# Altium project Projet_travelling_detecteur_V3.PrjPCB
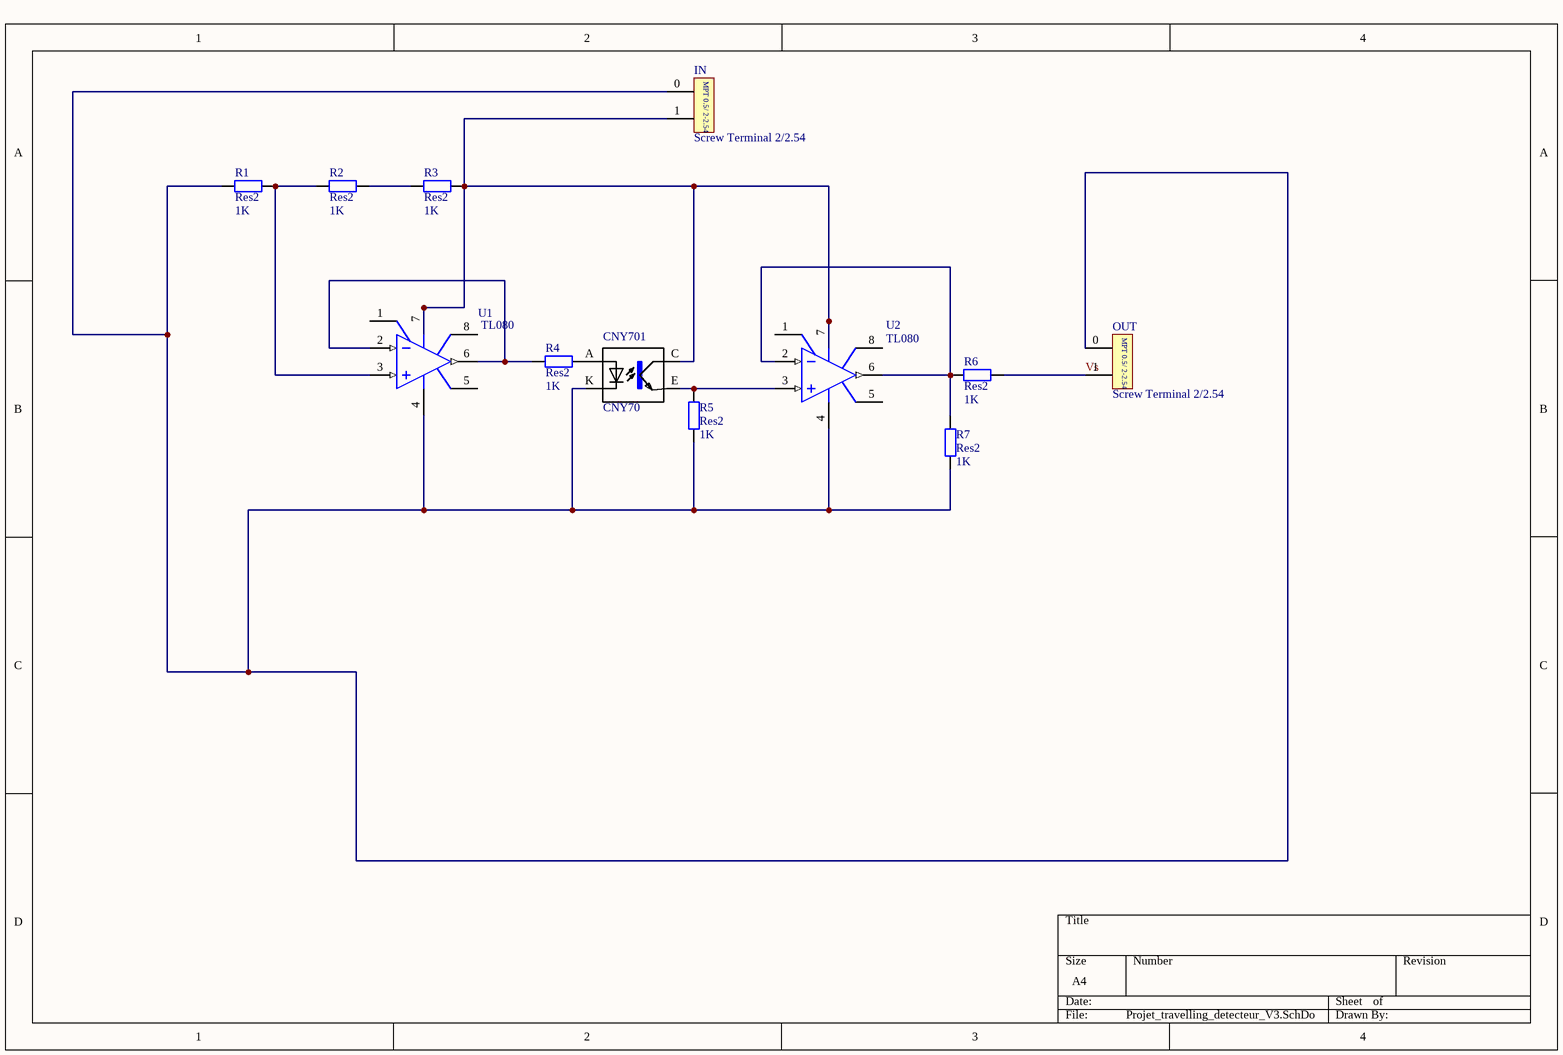
[diagram p0: Projet_travelling_detecteur_V3.SchDoc]
1 sheet, 12 parts. Net scope: global (net labels, ports and power ports of the same name join across sheets).
Board file: Projet_travelling_detecteur_V3.PcbDoc

## Sheet Projet_travelling_detecteur_V3.SchDoc
size A4

### Parts
CNY701  CNY70  [*4_CNY70(Primary)]
IN  Screw Terminal 2/2.54  [MPT_0.5-2-2.54]
OUT  Screw Terminal 2/2.54  [MPT_0.5-2-2.54]
R1  Res2  value 1K  [AXIAL-0.4]
R2  Res2  value 1K  [AXIAL-0.4]
R3  Res2  value 1K  [AXIAL-0.4]
R4  Res2  value 1K  [AXIAL-0.4]
R5  Res2  value 1K  [AXIAL-0.4]
R6  Res2  value 1K  [AXIAL-0.4]
R7  Res2  value 1K  [AXIAL-0.4]
U1  TL080  [DIL 8]
U2  TL080  [DIL 8]

### Nets
Vs: OUT.1 R6.2
NetCNY701_A: CNY701.A R4.2
NetCNY701_C: CNY701.C(COL) IN.1 R3.2 U1.7(V+) U2.7(V+)
NetCNY701_E: CNY701.E(EMI) R5.1 U2.3(IN+)
NetCNY701_K: CNY701.K(C) IN.0 OUT.0 R1.1 R5.2 R7.1 U1.4(V-) U2.4(V-)
NetR1_2: R1.2 R2.1 U1.3(IN+)
NetR2_2: R2.2 R3.1
NetR4_1: R4.1 U1.2(IN-) U1.6(OUT)
NetR6_1: R6.1 R7.2 U2.2(IN-) U2.6(OUT)

Not connected (* = marked no-connect by the designer): U1 1(BAL1/CMPEN) 5(BAL2) 8(CMPEN); U2 1(BAL1/CMPEN) 5(BAL2) 8(CMPEN)

### Notes on the sheet
- (in symbol Screw Terminal 2/2.54) MPT 0.5/ 2-2.54

### Library data of the parts
CNY701 = CNY70: Reflective Optical Sensor 0.197 _5mm_ PCB Mount; MF: Vishay; SnapEDA_Link: https://www.snapeda.com/parts/CNY70/Vishay%20Semiconductor%20Opto%20Division/view-part/230090/?ref=snap; MP: CNY70; Package: PCB Mount Vishay; Price: None; Availability: Unavailable; Value: *
IN OUT = Screw Terminal 2/2.54: MPT 0.5/ 2 contacts / 2.54 mm; Supplier 1: Farnell; Supplier Part Number 1: 3041359
R1-R7 = Res2: Resistor; Published: 8-Jun-2000; LatestRevisionDate: 17-Jul-2002; LatestRevisionNote: Re-released for DXP Platform.; PackageReference: AXIAL-0.4; Publisher: Altium Limited; PackageDescription: Axial Device, Thru-Hole; 2 Leads; 0.4 in Pin Spacing
U1 U2 = TL080: JFET-Input Operational Amplifier; Published: 16-Jan-2001; LatestRevisionDate: 04-Mar-2005; LatestRevisionNote: Stylized 3D Model Added.; DatasheetVersion: Nov-1988; PackageVersion: Jun-1999; PackageReference: P008; Publisher: Altium Limited; PackageDescription: DIP; 8 Leads; Row Spacing 7.62 mm; Pitch 2.54 mm; Code_JEDEC: MO-001-AN; ComponentLink1Description: Manufacturer Link; ComponentLink1URL: http://www.ti.com/; ComponentLink2Description: Datasheet; ComponentLink2URL: http://www-s.ti.com/sc/ds/tl080.pdf; Supplier 1: Digi-Key; Supplier Part Number 1: TL080CPE4-ND